# EAGLE schematic TPS22680 (EAGLE 9.6.2)
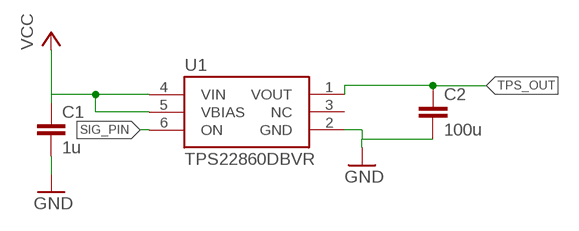
[diagram p0: schematic, sheet 1]

## Parts
C1  1u  C-EUC0603  [C0603]
C2  100u  C-EUC0603  [C0603]
U1  TPS22860DBVR  [R-PDSO-G6]

## Nets
GND: C1.2 C2.2 U1.2(GND)
SIG_PIN: U1.6(ON)
TPS_OUT: C2.1 U1.1(VOUT)
VCC: C1.1 U1.4(VIN) U1.5(VBIAS)
Unconnected: U1.3(NC)

## Library data of the parts
C1 C2 = rcl:C-EU: CAPACITOR, European symbol; SPICEPREFIX: C
U1 = texas-custom:TPS22860DBVR: Power Switch ICs - Power Distribution TPS22860 Ultra-low leakage load switch 6-SOT-23 -40 to 85